# EasyEDA schematic 1-Schematic_Nakuja Remix 4.json
TITLE: Sheet_1; REV: 1.0; Date: 2022-04-21; Sheet: 1/1; Drawn By: Rodney Osodo; Company: Your Company
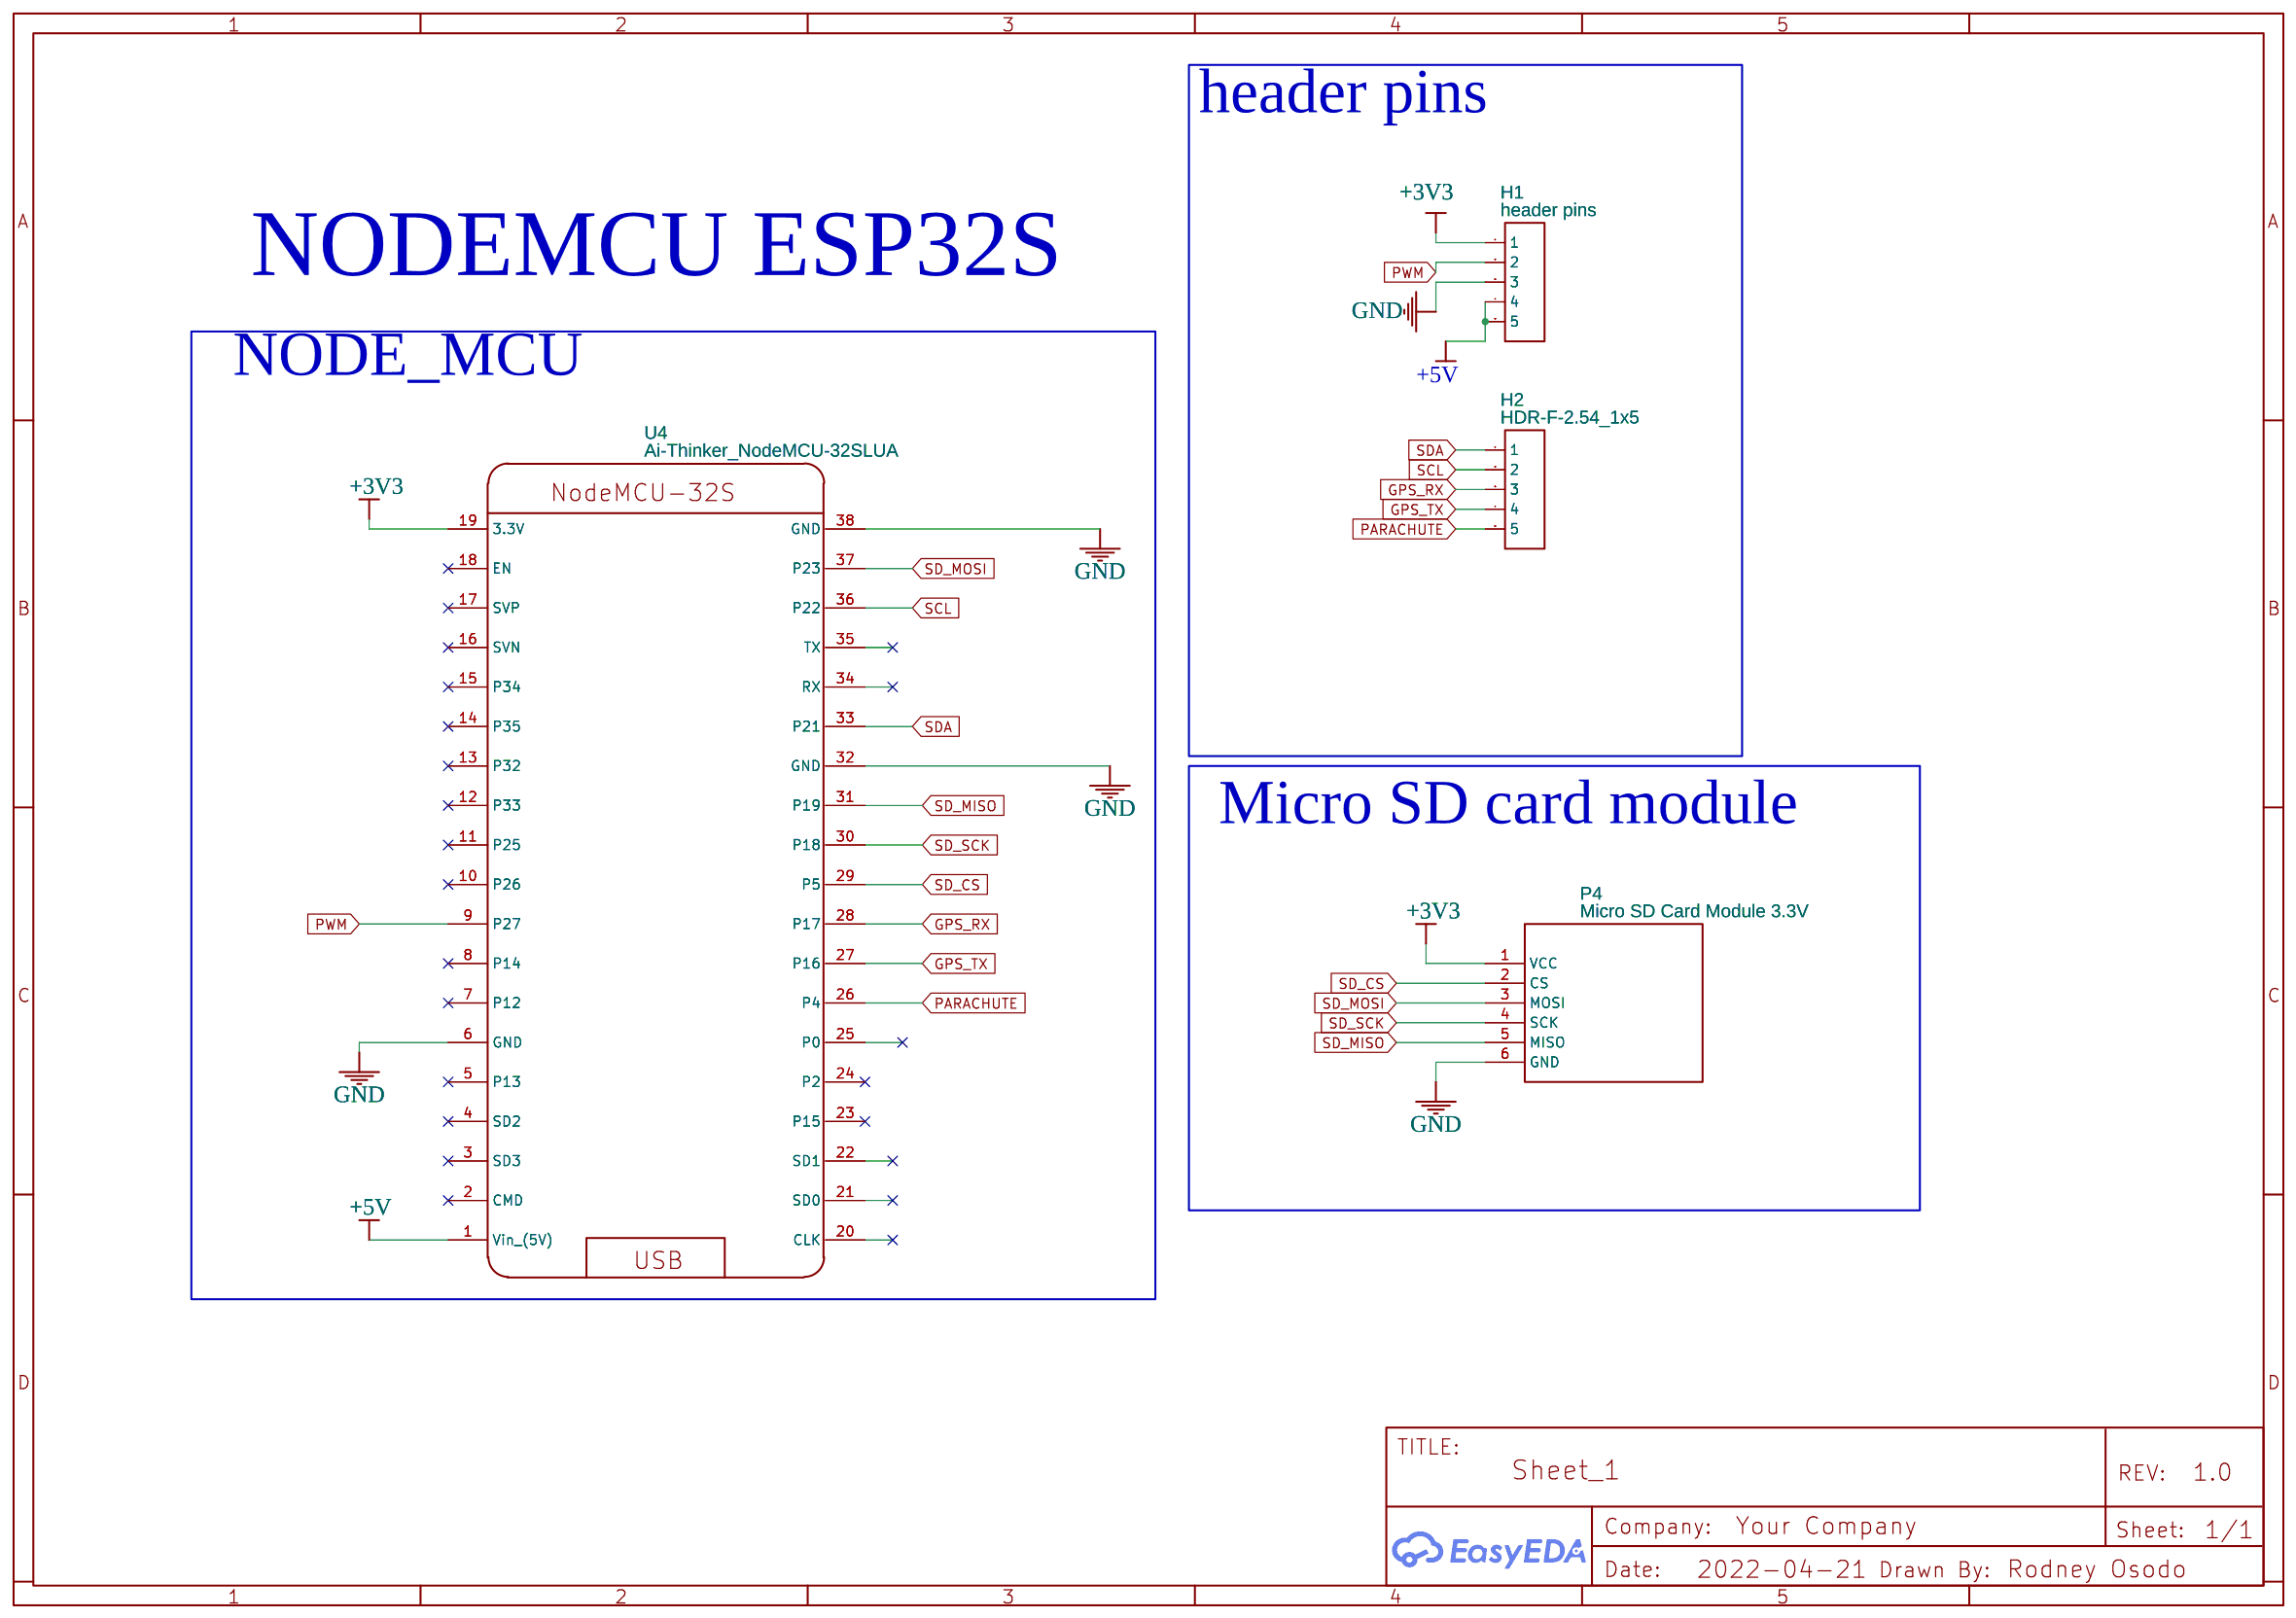
[diagram p0: schematic sheet]

## Parts
H1  header pins  [HDR-F-2.54_1X5]
H2  HDR-F-2.54_1x5  [HDR-F-2.54_1X5]
P4  Micro SD Card Module 3.3V  [MICRO SD CARD MODULE 3.3V]
U4  Ai-Thinker_NodeMCU-32SLUA  [AI-THINKER_NODEMCU-32SLUA]

## Library data of the parts
H1 H2 = HDR-F-2.54_1x5: Supplier Part: C50950; Supplier: LCSC; Contributor: LCEDA_Lib
P4 = Micro SD Card Module 3.3V: sourceId: n1LFXQ8qk; Contributor: Копец Екатерина
U4 = Ai-Thinker_NodeMCU-32SLUA: Supplier: LCSC; Supplier Part: C111436; Manufacturer: Ai-Thinker; Manufacturer Part: NodeMCU-32SLua; Contributor: jobsonp checked by LCSC

## Nets
+3V3: H1.1 P4.1(VCC) U4.19(3.3V)
+5V: H1.4 H1.5 U4.1(Vin (5V))
GND: H1.3 P4.6(GND) U4.6(GND) U4.32(GND) U4.38(GND)
GPS_RX: H2.3 U4.28(P17)
GPS_TX: H2.4 U4.27(P16)
PARACHUTE: H2.5 U4.26(P4)
PWM: H1.2 U4.9(P27)
SCL: H2.2 U4.36(P22)
SD_CS: P4.2(CS) U4.29(P5)
SD_MISO: P4.5(MISO) U4.31(P19)
SD_MOSI: P4.3(MOSI) U4.37(P23)
SD_SCK: P4.4(SCK) U4.30(P18)
SDA: H2.1 U4.33(P21)

Not connected (* = marked no-connect by the designer): U4 2(CMD)* 3(SD3)* 4(SD2)* 5(P13)* 7(P12)* 8(P14)* 10(P26)* 11(P25)* 12(P33)* 13(P32)* 14(P35)* 15(P34)* 16(SVN)* 17(SVP)* 18(EN)* 20(CLK) 21(SD0) 22(SD1) 23(P15)* 24(P2)* 25(P0) 34(RX) 35(TX)

## Notes on the sheet
- header pins
- NODEMCU ESP32S
- NODE_MCU
- Micro SD card module
